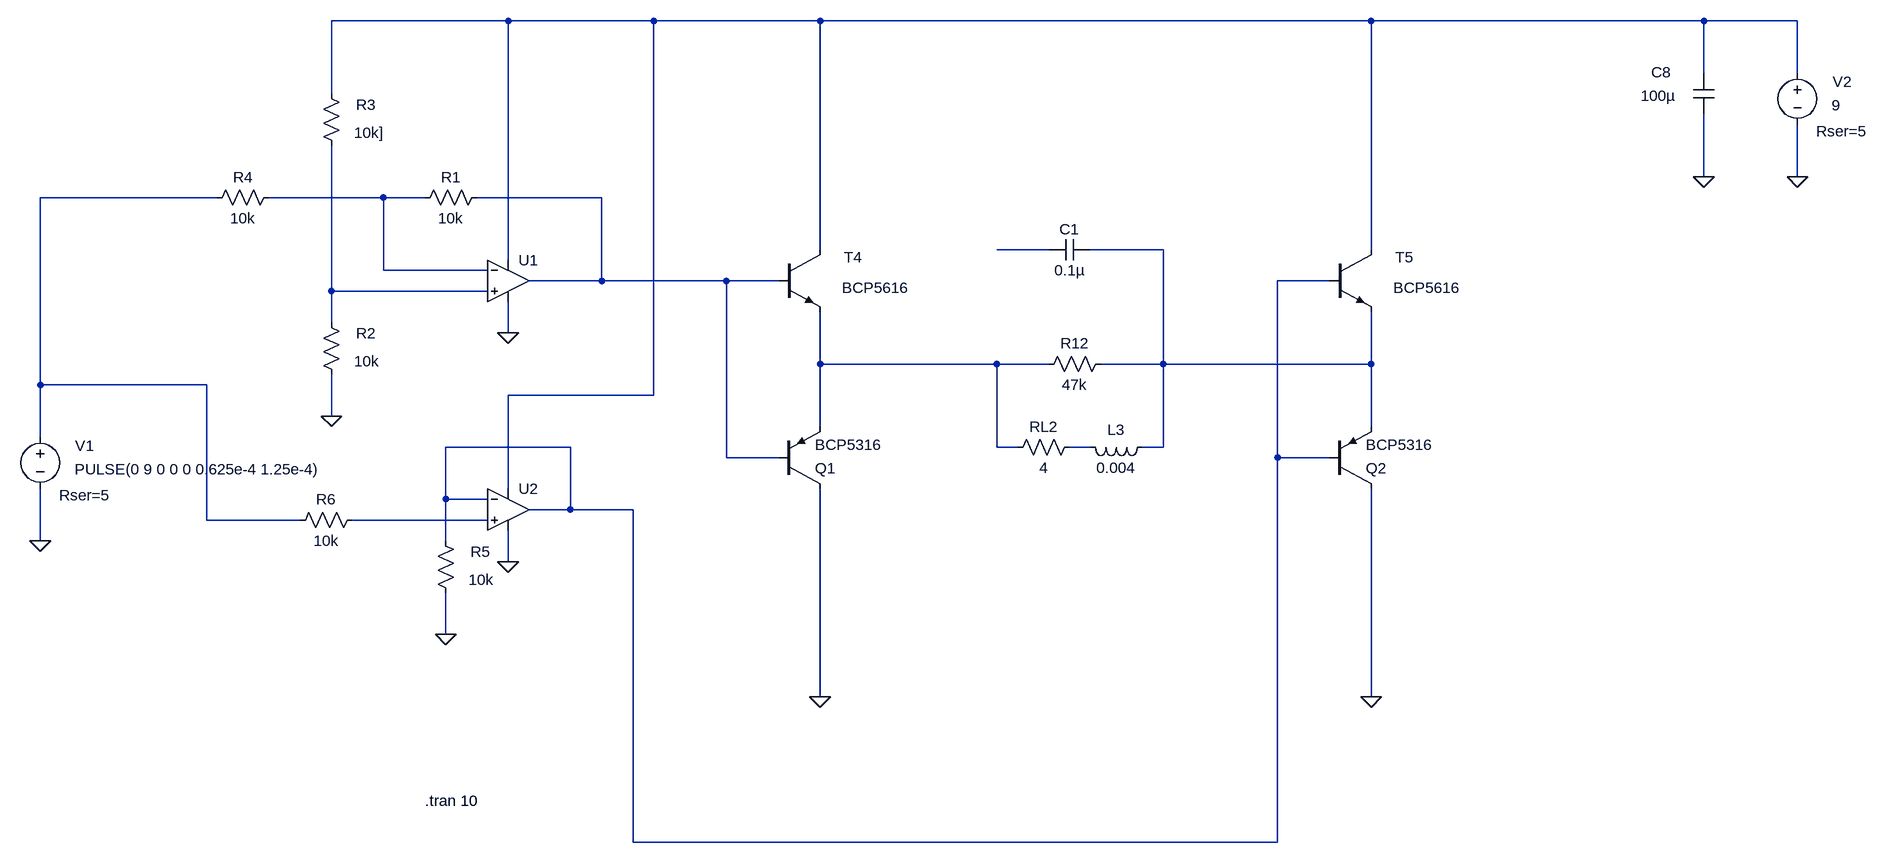
[diagram p0: schematic LC_OscillatorCapsFeedback3_bridge.asc]
LC_OscillatorCapsFeedback3_bridge.asc, the LTspice schematic file:
Version 4
SHEET 1 3588 1012
WIRE 1488 -256 1216 -256
WIRE 1712 -256 1488 -256
WIRE 1968 -256 1712 -256
WIRE 2816 -256 1968 -256
WIRE 3328 -256 2816 -256
WIRE 3472 -256 3328 -256
WIRE 3328 -176 3328 -256
WIRE 3472 -176 3472 -256
WIRE 1216 -144 1216 -256
WIRE 3328 -16 3328 -112
WIRE 3472 -16 3472 -96
WIRE 1040 16 768 16
WIRE 1296 16 1120 16
WIRE 1360 16 1296 16
WIRE 1632 16 1440 16
WIRE 1968 96 1968 -256
WIRE 2320 96 2240 96
WIRE 2496 96 2384 96
WIRE 2816 96 2816 -256
WIRE 1488 112 1488 -256
WIRE 1296 128 1296 16
WIRE 1456 128 1296 128
WIRE 1632 144 1632 16
WIRE 1632 144 1520 144
WIRE 1824 144 1632 144
WIRE 1904 144 1824 144
WIRE 2752 144 2672 144
WIRE 1216 160 1216 -64
WIRE 1456 160 1216 160
WIRE 1216 208 1216 160
WIRE 1488 224 1488 176
WIRE 1968 272 1968 192
WIRE 2240 272 1968 272
WIRE 2320 272 2240 272
WIRE 2496 272 2496 96
WIRE 2496 272 2400 272
WIRE 2816 272 2816 192
WIRE 2816 272 2496 272
WIRE 768 304 768 16
WIRE 1024 304 768 304
WIRE 1712 320 1712 -256
WIRE 1712 320 1488 320
WIRE 1216 352 1216 288
WIRE 1968 368 1968 272
WIRE 2816 368 2816 272
WIRE 768 384 768 304
WIRE 1584 400 1392 400
WIRE 2240 400 2240 272
WIRE 2272 400 2240 400
WIRE 2384 400 2352 400
WIRE 2496 400 2496 272
WIRE 2496 400 2464 400
WIRE 1824 416 1824 144
WIRE 1904 416 1824 416
WIRE 2672 416 2672 144
WIRE 2752 416 2672 416
WIRE 1488 464 1488 320
WIRE 1392 480 1392 400
WIRE 1456 480 1392 480
WIRE 1584 496 1584 400
WIRE 1584 496 1520 496
WIRE 1680 496 1584 496
WIRE 1024 512 1024 304
WIRE 1168 512 1024 512
WIRE 1456 512 1248 512
WIRE 768 544 768 464
WIRE 1392 544 1392 480
WIRE 1488 576 1488 528
WIRE 1392 688 1392 624
WIRE 1968 784 1968 464
WIRE 2816 784 2816 464
WIRE 1680 1008 1680 496
WIRE 2672 1008 2672 416
WIRE 2672 1008 1680 1008
FLAG 3472 -16 0
FLAG 3328 -16 0
FLAG 2816 784 0
FLAG 1968 784 0
FLAG 768 544 0
FLAG 1488 224 0
FLAG 1488 576 0
FLAG 1216 352 0
FLAG 1392 688 0
SYMBOL npn 1904 96 R0
WINDOW 0 101 12 Left 2
WINDOW 3 98 59 Left 2
SYMATTR InstName T4
SYMATTR Value BCP5616
SYMBOL pnp 1904 464 M180
SYMATTR InstName Q1
SYMATTR Value BCP5316
SYMBOL npn 2752 96 R0
WINDOW 0 101 12 Left 2
WINDOW 3 98 59 Left 2
SYMATTR InstName T5
SYMATTR Value BCP5616
SYMBOL pnp 2752 464 M180
SYMATTR InstName Q2
SYMATTR Value BCP5316
SYMBOL voltage 3472 -192 R0
WINDOW 0 54 30 Left 2
WINDOW 3 53 66 Left 2
WINDOW 123 0 0 Left 0
WINDOW 39 29 106 Left 2
SYMATTR InstName V2
SYMATTR Value 9
SYMATTR SpiceLine Rser=5
SYMBOL cap 3312 -176 R0
WINDOW 0 -65 -1 Left 2
WINDOW 3 -81 35 Left 2
SYMATTR InstName C8
SYMATTR Value 100µ
SYMBOL ind 2480 384 R90
WINDOW 0 5 56 VBottom 2
WINDOW 3 32 56 VTop 2
SYMATTR InstName L3
SYMATTR Value 0.004
SYMBOL res 2368 384 R90
WINDOW 0 0 56 VBottom 2
WINDOW 3 32 56 VTop 2
SYMATTR InstName RL2
SYMATTR Value 4
SYMBOL res 2416 256 R90
WINDOW 0 0 56 VBottom 2
WINDOW 3 32 56 VTop 2
SYMATTR InstName R12
SYMATTR Value 47k
SYMBOL voltage 768 368 R0
WINDOW 0 54 30 Left 2
WINDOW 3 53 66 Left 2
WINDOW 123 0 0 Left 0
WINDOW 39 29 106 Left 2
SYMATTR InstName V1
SYMATTR Value PULSE(0 9 0 0 0 0.625e-4 1.25e-4)
SYMATTR SpiceLine Rser=5
SYMBOL res 1456 0 R90
WINDOW 0 0 56 VBottom 2
WINDOW 3 32 56 VTop 2
SYMATTR InstName R1
SYMATTR Value 10k
SYMBOL res 1200 192 R0
WINDOW 0 54 33 Left 2
WINDOW 3 51 76 Left 2
SYMATTR InstName R2
SYMATTR Value 10k
SYMBOL res 1200 -160 R0
WINDOW 0 54 33 Left 2
WINDOW 3 51 76 Left 2
SYMATTR InstName R3
SYMATTR Value 10k]
SYMBOL res 1136 0 R90
WINDOW 0 0 56 VBottom 2
WINDOW 3 32 56 VTop 2
SYMATTR InstName R4
SYMATTR Value 10k
SYMBOL res 1376 528 R0
WINDOW 0 54 33 Left 2
WINDOW 3 51 76 Left 2
SYMATTR InstName R5
SYMATTR Value 10k
SYMBOL res 1264 496 R90
WINDOW 0 0 56 VBottom 2
WINDOW 3 32 56 VTop 2
SYMATTR InstName R6
SYMATTR Value 10k
SYMBOL OpAmps\\UniversalOpAmp 1488 144 R0
SYMATTR InstName U1
SYMBOL OpAmps\\UniversalOpAmp 1488 496 R0
SYMATTR InstName U2
SYMBOL cap 2384 80 R90
WINDOW 0 0 32 VBottom 2
WINDOW 3 32 32 VTop 2
SYMATTR InstName C1
SYMATTR Value 0.1µ
TEXT 1360 944 Left 2 !.tran 10

The netlist it stands for:
* LC_OscillatorCapsFeedback3_bridge.asc
Q§T4 N001 N004 N009 0 BCP5616
Q1 0 N004 N009 0 BCP5316
Q§T5 N001 N007 N006 0 BCP5616
Q2 0 N007 N006 0 BCP5316
V2 N001 0 9 Rser=5
C8 N001 0 100µ
L3 N006 N010 0.004
RL2 N010 N009 4
R12 N006 N009 47k
V1 N002 0 PULSE(0 9 0 0 0 0.625e-4 1.25e-4) Rser=5
R1 N004 N003 10k
R2 N008 0 10k
R3 N001 N008 10k]
R4 N003 N002 10k
R5 N007 0 10k
R6 N011 N002 10k
XU1 N008 N003 N001 0 N004 level1 Avol=1Meg GBW=10Meg Vos=0 En=0 Enk=0 In=0 Ink=0 Rin=500Meg  ; pins In+ In- V+ V- OUT
XU2 N011 N007 N001 0 N007 level1 Avol=1Meg GBW=10Meg Vos=0 En=0 Enk=0 In=0 Ink=0 Rin=500Meg  ; pins In+ In- V+ V- OUT
C1 N006 N005 0.1µ
.model NPN NPN
.model PNP PNP
.lib standard.bjt
.tran 10
.lib UniversalOpAmp1.lib
.backanno
.end